# Altium schematic sheet ASCII Terminal.SchDoc
size A4; SheetNumber: 1; SheetTotal: 1
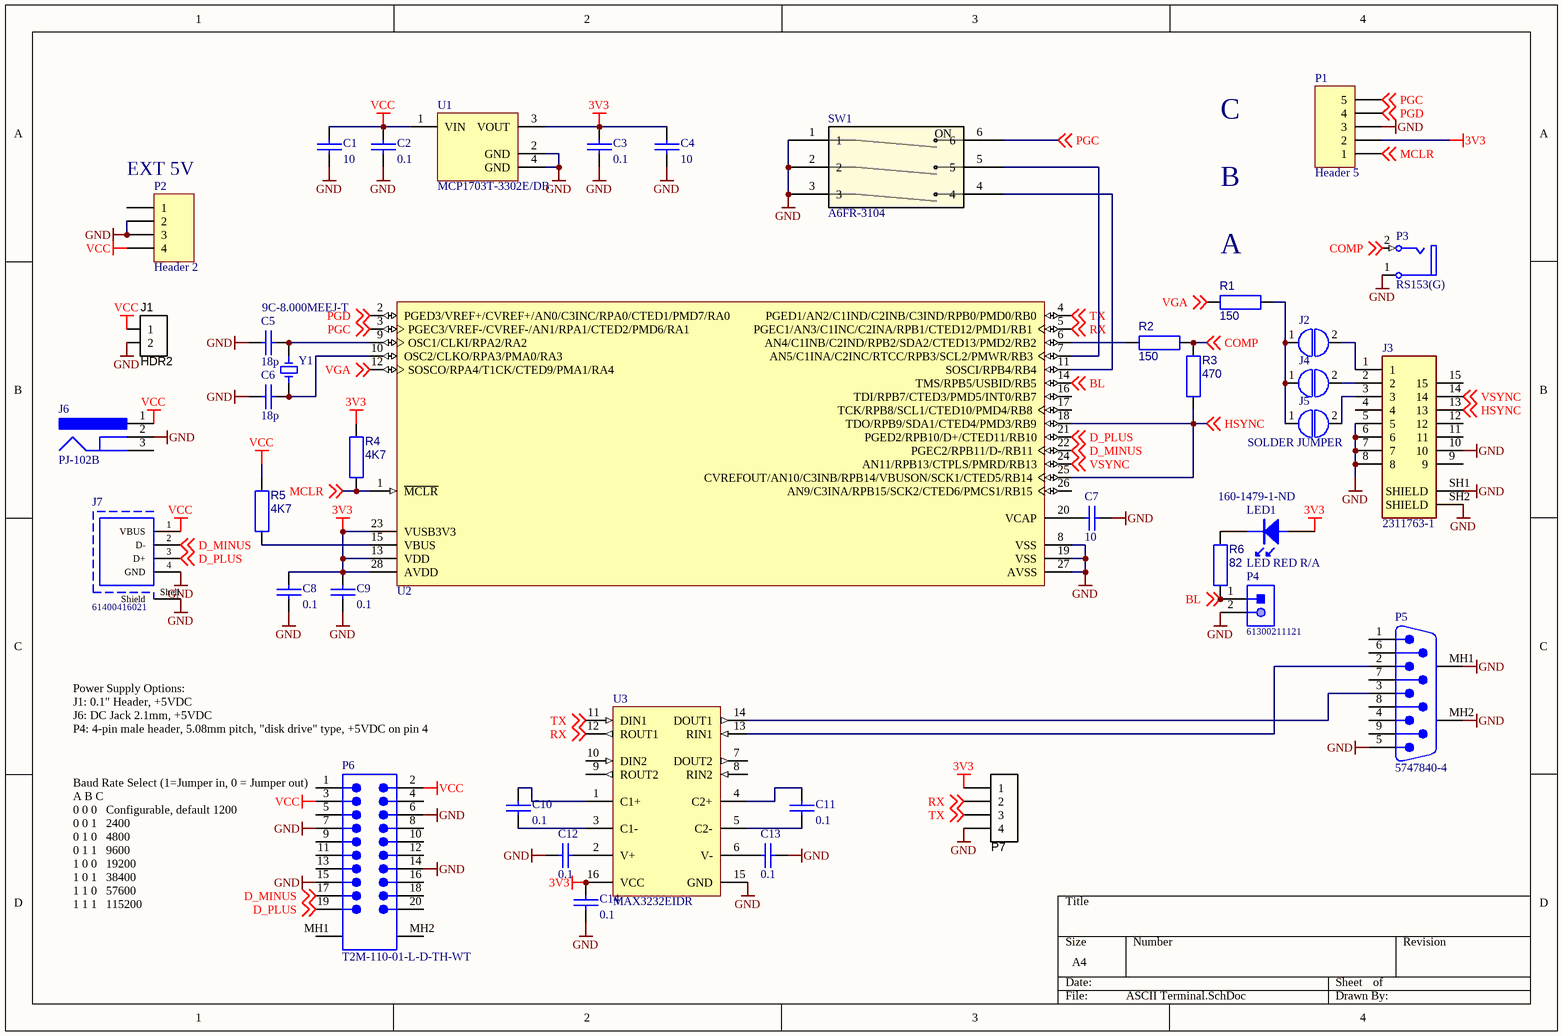
[diagram p0: ASCII Terminal.SchDoc]

## Parts
C1  value 10  [C0805-S]  (hidden comment: VJ0805V475ZXQTW1BC)
C2  value 0.1  [C0805-S]  (hidden comment: VJ0805V475ZXQTW1BC)
C3  value 0.1  [C0805-S]  (hidden comment: VJ0805V475ZXQTW1BC)
C4  value 10  [C0805-S]  (hidden comment: VJ0805V475ZXQTW1BC)
C5  18p  [C0805-S]
C6  18p  [C0805-S]
C7  value 10  [C0805-S]  (hidden comment: VJ0805V475ZXQTW1BC)
C8  value 0.1  [C0805-S]  (hidden comment: VJ0805V475ZXQTW1BC)
C9  value 0.1  [C0805-S]  (hidden comment: VJ0805V475ZXQTW1BC)
C10  value 0.1  [C0805-S]  (hidden comment: VJ0805V475ZXQTW1BC)
C11  value 0.1  [C0805-S]  (hidden comment: VJ0805V475ZXQTW1BC)
C12  value 0.1  [C0805-S]  (hidden comment: VJ0805V475ZXQTW1BC)
C13  value 0.1  [C0805-S]  (hidden comment: VJ0805V475ZXQTW1BC)
C14  value 0.1  [C0805-S]  (hidden comment: VJ0805V475ZXQTW1BC)
J1  HDR2  [HDR1X2 - KK]
J2  SOLDER JUMPER  [SOLDER JUMPER]  (value not drawn)  (no BOM)
J3  2311763-1  [TE_1-1734530-1]
J4  SOLDER JUMPER  [SOLDER JUMPER]  (value not drawn)  (no BOM)
J5  SOLDER JUMPER  [SOLDER JUMPER]  (no BOM)
J6  PJ-102B  [CUI-PJ-102B_V]
J7  61400416021  [61400416021]
LED1  LED RED R/A  Supplier Part Number 1: 160-1479-1-ND  [LTST-S270]
P1  Header 5  [HDR1X5]  (no BOM)
P2  Header 2  [1745521]
P3  RS153(G)  [RCAJ-01X]
P4  61300211121  [61300211121]
P5  5747840-4  [TECO-5747840-4_V]
P6  T2M-110-01-L-D-TH-WT  [SMTC-T2M-110-01-X-D-TH-WT]
P7  Programmer  [HDR1X4_2.54mmp]  (value not drawn)  (no BOM)
R1  150  [RESC2012X70N]
R2  150  [RESC2012X70N]
R3  470  [RESC2012X70N]
R4  4K7  [RESC2012X70N]
R5  4K7  [RESC2012X70N]
R6  82  [RESC2012X70N]
SW1  A6FR-3104  [SW_A6FR-3104_OMR]
U1  MCP1703T-3302E/DB  [SOT-223-DB3_L]
U2  PIC32MX250F128B-I/SO  [MCHP-SOIC-SO28_M]  (value not drawn)
U3  MAX3232EIDR  [D0016A_N]
Y1  9C-8.000MEEJ-T  [XTAL_9C-8.000MEEJ-T]

## Nets
3V3: C3.1 C4.1 C8.1 C9.1 C14.1 LED1.A P1.2 P7.1 R4.2 U1.3(VOUT) U2.13(VDD) U2.23(VUSB3V3) U2.28(AVDD) U3.16(VCC)
GND: C1.2 C2.2 C3.2 C4.2 C5.1 C6.1 C7.2 C8.2 C9.2 C12.1 C13.2 C14.2 J1.2 J3.5 J3.6 J3.7 J3.8 J3.10 J3.SH1(SHIELD) J3.SH2(SHIELD) J6.2 J7.4(GND) J7.Shell(Shield) P1.3 P2.2 P2.3 P3.1(Ground) P4.2 P5.5 P5.MH1 P5.MH2 P6.6 P6.7 P6.14 P6.15 P7.4 SW1.1 SW1.2 SW1.3 U1.2(GND) U1.4(GND) U2.8(VSS) U2.19(VSS) U2.27(AVSS) U3.15(GND)
VCC: C1.1 C2.1 J1.1 J6.1 J7.1(VBUS) P2.4 P6.2 P6.3 R5.2 U1.1(VIN)
BL: P4.1 R6.2 U2.14(TMS/RPB5/USBID/RB5) ; off-sheet BL
COMP: P3.2(Signal) R2.1 R3.1 ; off-sheet COMP
D_MINUS: J7.2(D-) P6.17 U2.22(PGEC2/RPB11/D-/RB11) ; off-sheet D_MINUS
D_PLUS: J7.3(D+) P6.19 U2.21(PGED2/RPB10/D+/CTED11/RB10) ; off-sheet D_PLUS
HSYNC: J3.13 R3.2 U2.18(TDO/RPB9/SDA1/CTED4/PMD3/RB9) U2.25(CVREFOUT/AN10/C3INB/RPB14/VBUSON/SCK1/CTED5/RB14) ; off-sheet HSYNC
MCLR: P1.1 R4.1 U2.1(~{MCLR}) ; off-sheet MCLR
PGC: P1.5 SW1.6 U2.3(PGEC3/VREF-/CVREF-/AN1/RPA1/CTED2/PMD6/RA1) ; off-sheet PGC
PGD: P1.4 U2.2(PGED3/VREF+/CVREF+/AN0/C3INC/RPA0/CTED1/PMD7/RA0) ; off-sheet PGD
RX: P7.2 U2.5(PGEC1/AN3/C1INC/C2INA/RPB1/CTED12/PMD1/RB1) U3.12(ROUT1) ; off-sheet RX
TX: P7.3 U2.4(PGED1/AN2/C1IND/C2INB/C3IND/RPB0/PMD0/RB0) U3.11(DIN1) ; off-sheet TX
VGA: R1.2 U2.12(SOSCO/RPA4/T1CK/CTED9/PMA1/RA4) ; off-sheet VGA
VSYNC: J3.14 U2.24(AN11/RPB13/CTPLS/PMRD/RB13) ; off-sheet VSYNC
NetC5_2: C5.2 U2.9(OSC1/CLKI/RPA2/RA2) Y1.2
NetC6_2: C6.2 U2.10(OSC2/CLKO/RPA3/PMA0/RA3) Y1.1
NetC7_1: C7.1 U2.20(VCAP)
NetC10_1: C10.1 U3.1(C1+)
NetC10_2: C10.2 U3.3(C1-)
NetC11_1: C11.1 U3.4(C2+)
NetC11_2: C11.2 U3.5(C2-)
NetC12_2: C12.2 U3.2(V+)
NetC13_1: C13.1 U3.6(V-)
NetJ2_1: J2.1 J4.1 J5.1 R1.1
NetJ2_2: J2.2 J3.1
NetJ3_2: J3.2 J4.2
NetJ3_3: J3.3 J5.2
NetLED1_K: LED1.K R6.1
NetP5_2: P5.2 U3.13(RIN1)
NetP5_3: P5.3 U3.14(DOUT1)
NetR2_2: R2.2 U2.6(AN4/C1INB/C2IND/RPB2/SDA2/CTED13/PMD2/RB2)
NetR5_1: R5.1 U2.15(VBUS)
NetSW1_4: SW1.4 U2.11(SOSCI/RPB4/RB4)
NetSW1_5: SW1.5 U2.7(AN5/C1INA/C2INC/RTCC/RPB3/SCL2/PMWR/RB3)

Not connected (* = marked no-connect by the designer): J3 4 9 11 12 15; J6 3; P2 1; P5 1 4 6 7 8 9; P6 1 4 5 8 9 10 11 12 13 16 18 20 MH1 MH2; U2 16(TDI/RPB7/CTED3/PMD5/INT0/RB7) 17(TCK/RPB8/SCL1/CTED10/PMD4/RB8) 26(AN9/C3INA/RPB15/SCK2/CTED6/PMCS1/RB15); U3 7(DOUT2) 8(RIN2) 9(ROUT2) 10(DIN2)

## Notes on the sheet
- (near P2) EXT 5V
- C
- B
- (near R1) A
- (near P6) Power Supply Options:
  J1: 0.1" Header, +5VDC
  J6: DC Jack 2.1mm, +5VDC
  P4: 4-pin male header, 5.08mm pitch, "disk drive" type, +5VDC on pin 4
- (near P6) Baud Rate Select (1=Jumper in, 0 = Jumper out)
  A B C
  0 0 0   Configurable, default 1200
  0 0 1   2400
  0 1 0   4800
  0 1 1   9600
  1 0 0   19200
  1 0 1   38400
  1 1 0   57600
  1 1 1   115200
- (in symbol A6FR-3104) ON

## Library data of the parts
C1 C4 C7 = CAP: Capacitor; P/N: LMK212ABJ106KG-T
C2 C3 C8-C14 = CAP: Capacitor; P/N: UMK212BJ104KG-T
C5 C6 = CAP: Capacitor; P/N: VJ0805A180FXXCW1BC; Value: 18p
J1 = Header2P: Header, 2-pin; P/N: 0022232021
J3 = 2311763-2: 15 Position D-Sub, High Density Receptacle, Female Sockets Connector; MP: 1-1734530-1; MF: TE Connectivity; Package: None; TE_purchase_URL: https://www.te.com/usa-en/product-1-1734530-1.html?te_bu=Cor&te_type=disp&te_campaign=seda_glo_cor-seda-global-disp-prtnr-fy19-seda-model-bom-cta_sma-317_1&elqCampaignId=32493; Value: *; SnapEDA_Link: https://www.snapeda.com/parts/1-1734530-1/TE%20Connectivity%20AMP%20Connectors/view-part/289078/?ref=snap; Price: None; P/N: 2311763-1
J6 = CMP-2000-06900-1: Through Hole Right Angle DC Power Jack, 2.5 A, 2.5 mm Center Pin, 3 Position, -25 to 85 degC, RoHS, Bulk; Manufacturer: CUIInc.; Insulation Resistance: 100MOhms; Inside Contact Diameter: 2.5mm; Outside Contact Diameter: 6.5mm; Voltage Rating: 24V; Current Rating: 2.5A; Brand: CUI; Datasheet URL: http://www.cui.com/product/resource/pj-102b.pdf; Housing Material: PolybutyleneTerephthalate(PBT); Operating Temperature Range: -25Cto+85C; Package Reference: PJ-102B; Factory Pack Quantity: 280; RoHS: True; Contact Material: Copper; Datasheet Version: Rev. 1.03, 04/2016; Product: Jacks; Mounting Angle: Right; Mounting Style: ThroughHole; Flammability Rating: UL94V-0; Product Category: DCPowerConnectors; Contact Gender: Male; Termination Style: ThroughHole; Manufacturer URL: http://www.cui.com/; Mounting Technology: ThroughHole; Package Description: 3-Pin Through Hole Device, Body 14.4 x 9 mm, Height 11 mm; Contact Plating: Nickel; Packaging: Bulk; Connector Type: DCPowerJack; P/N: PJ-102B
J7 = CMP-1502-03227-1: USB 2.0 Type A Receptacle WR-COM, Horizontal, THT; Manufacturer: Wurth Elektronik; Working Voltage: 30VAC; Rated Current: 1.5A; Contact Resistance: 20mOhm; Manufacturer URL: http://www.we-online.de; Publisher: WurthElektronik; Packaging: Tray; Operating Temperature: -40to105degC; Orientation: Horizontal; Mounting Technology: THT; Part Number: 61400416021; Gender: Receptacle; Package Reference: 61400416021; Connector Type: USB2.0TypeA; Datasheet URL: https://katalog.we-online.de/em/datasheet/61400416021.pdf; P/N: 61400416021
LED1 = LED_SIDE_1_6_1_15: P/N: LTST-S270KRKT; Supplier 1: Digi-Key
P1 = Header 5: Header, 5-Pin; LatestRevisionDate: 17-Jul-2002; LatestRevisionNote: Re-released for DXP Platform.; Publisher: Altium Limited
P2 = Header 4: Header, 4-Pin; P/N: 174552-1; LatestRevisionDate: 17-Jul-2002; LatestRevisionNote: Re-released for DXP Platform.; Publisher: Altium Limited
P3 = RCA: RCA Phono Jack, Right Angle, Thru-Hole, Snap-In; PCB_Layout: Complies with manufacturer's recommendation.; DrillAndSlotSize: Corresponds to nominal value.; P/N: RCJ-014; Published: 15-Jul-2004; LatestRevisionDate: 15-Jul-2004; LatestRevisionNote: Component Replaced.; DatasheetDocument: 7-Jul-2000; PackageDocument: 7-Jul-2000; PackageReference: 161; Publisher: Altium Limited; ComponentLink1Description: Manufacturer Link; ComponentLink1URL: http://www.mouser.com/kobiconn/
P4 = CMP-1712-00002-4: THT Vertical Pin Header WR-PHD, Pitch 2.54 mm, Single Row, 2 pins; Manufacturer: Wurth Elektronik; Rated Current: 3A; Gender: Male; Withstanding Voltage: 500VAC; Working Voltage: 250VAC; Pitch: 2.54mm; Contact Resistance: 20mOhm; Pin Number: 2; Mounting Technology: THT; Orientation: Vertical; Operating Temperature: -40to105degC; Packaging: Bag; Publisher: WurthElektronik; Datasheet URL: https://katalog.we-online.de/em/datasheet/6130xx11121.pdf; Manufacturer URL: http://www.we-online.de; Row Number: Single; Package Reference: 61300211121; Part Number: 61300211121; P/N: 61300211121
P5 = CMP-2000-05648-1: Male D-Sub Connector, Pitch 1.37 mm, 9 Position, Height 12.93 mm, Tail Length 3.55 mm, -55 to 105 degC, RoHS, Tray; Manufacturer: TE Connectivity; Current Rating: 6A; 3D Model: 5747840-4.pdf; Connector Type: Plug,MalePins; Catalog Drawings: AMPD-SubMale.318; Other Names: A32092; Product Training Modules: AMPLIMITED-SubConnectors; Number of Positions: 9; Dynamic Catalog: AMPLIMITEHD-20Series; Flange Feature: Housing/Shell(4-40); Mating Products: 5-747905-7-ND / -CONND-SUBRCPT9POSVERTSLD / 5-787355-1-ND / -CONNRCPT9POSVERTSOLDERCUP / 5746861-4-ND / -CONNRECEPT9POSGOLDIDC / A32510-ND / -CONND-SUBRCPT9POSSLDCUPAU / AFL09B-ND / -CONND-SUBRECEPT9POS30GOLD / A31975-ND / -CONND-SUBRECEPT9P22-26AWGAU / A31974-ND / -CONND-SUBRECEPT9P20-22AWGAU / A31973-ND / -CONND-SUBRECEPT9P26-30AWGAU / A31931-ND / -CONND-SUBRCPT9POS22-26AWGAU; Featured Product: AMPLIMITED-SubminiatureConnectors; Voltage Rating: 125V; Connector Style: D-Sub; Mounting Technology: ThroughHole; Features: BoardLock,GroundStrap,GroundingIndents; Operating Temperature: -55°C~105°C; Standard Package: 130; Termination: Solder; Contact Finish: Gold; Family: D-SubConnectors; Package Reference: 5747840-4; Package Description: 9-Pin Through Hole Device, Body 30.81 x 18.62 mm, Pitch 1.37 mm; Category: Connectors,Interconnects; Series: AMPLIMITEHD-20; Manufacturer URL: http://www.te.com/; Shell Size, Connector Layout: 1(DE,E); Color: Black; RoHS Information: 5747840-4StatementofCompliance; Shell Material, Finish: Steel,TinPlated; Datasheet URL: http://www.te.com/commerce/DocumentDelivery/DDEController?Action=showdoc&DocId=Customer+Drawing%7F5747840%7FD%7Fpdf%7FEnglish%7FENG_CD_5747840_D.pdf%7F5747840-4; Contact Finish Thickness: Flash; Datasheet Version: Rev. D, 01/2013; Mounting Type: ThroughHole,RightAngle; Number of Rows: 2; Contact Type: Signal; P/N: 5747840-4
P6 = CMP-1029-00094-1: High Reliability Cable Header, Through-hole, Vertical, -55 to 125 degC, 2 mm Pitch, 20-Pin, Male, RoHS; Manufacturer: Samtec; Pitch: 2 mm; ComponentLink3URL: http://www.samtec.com/documents/webfiles/cpdf/T2M-1XX-XX-X-D-XX-XX-MKT.pdf; Mounting Technology: Through-hole; Orientation: Vertical; ComponentLink2URL: http://d2a072wq521u33.cloudfront.net/catalog_english//t2m.pdf; ComponentLink1URL: http://www.samtec.com; ComponentLink2Description: Datasheet; PackageReference: T2M-110-01-X-D-TH-WT; ComponentLink1Description: Manufacturer URL; RoHS: True; ComponentLink3Description: Package Specification; PartNumber: T2M-110-01-L-D-TH-WT; PackageDescription: 2mm Shrouded Terminal Strip; PackageVersion: V, 3/2009; Temperature Range: -55 to 125 degC; DatasheetVersion: F-214; P/N: T2M-110-01-L-D-TH-WT
P7 = Header4P: Header 4-pin
R1 R2 = RES2: RESISTOR; P/N: CRCW0805150RFKEAC; Value: 150
R3 = RES2: RESISTOR; P/N: CRCW0805470RFKEAC; Value: 470
R4 R5 = RES2: RESISTOR; P/N: CRCW08054K70FKEAC; Value: 4K7
R6 = RES2: RESISTOR; P/N: CRCW080582R0FKEAC; Value: 82
SW1 = A6FR-3104: No Description Available; Built_By: EMA_Kyle; Vendor: Omron; SourceLibrary: Omron_2019-09-26; Copyright: Copyright (C) 2018 Accelerated Designs. All rights reserved; Manufacturer_Part_Number: A6FR-3104; RefDes: RefDes; Type: DEV; P/N: A6FR-3104
U1 = CMP-0136-00469-1: 250 mA, 16V, Low Quiescent Current LDO Regulator, 3-Pin SOT-223, Extended Temperature, Tape and Reel; PackageReference: SOT-223-DB3; PackageDescription: 3-Lead Plastic Small Outline Transistor (DB) [SOT-223]; PackageVersion: revBB, Aug-2009; DatasheetVersion: revD, Sep-2009; P/N: MCP1703T-3302E/DB
U2 = CMP-0048-00457-1: 32-bit Microcontroller with Audio and Graphics Interface, USB and Advanced Analog, 50 MHz, 19 I/O, PMP, -40 to 85 degC, 28-pin SOIC (SO28), Tube; Manufacturer: Microchip; DatasheetVersion: Rev. E; PartNumber: PIC32MX250F128B-I/SO; ComponentLink4Description: Product URL; Mounting Technology: Surface Mount; ComponentLink2Description: Datasheet; PackageDescription: 28-Lead Plastic Small Outline, 17.9 x 7.5 mm Body, 1.27 mm Pitch; ComponentLink3Description: Package Specification; ComponentLink1Description: Manufacturer URL; PackageReference: SOIC-SO28; PackageVersion: C04-052C; ComponentLink2URL: http://ww1.microchip.com/downloads/en/DeviceDoc/61168E.pdf; ComponentLink3URL: http://www.microchip.com/stellent/groups/techpub_sg/documents/packagingspec/en012702.pdf; ComponentLink4URL: http://www.microchip.com/PIC32MX250F128B; ComponentLink1URL: http://www.microchip.com; P/N: PIC32MX250F128B-I/SO
U3 = CMP-0299-00792-2: 3-V to 5.5-V Multichannel RS-232 Line Driver / Receiver with ±15-kV IEC ESD Protection, -40 to 85 degC, 16-Pin SOIC (D), Green (RoHS & no Sb/Br); Drivers Per Package: 2; IEC-61000-4-2 SUPPORT: TRUE; Supply Voltage(s)(V): 3.3 or 5.0; ICC(Max)(mA): 1; ESD HBM(kV): +/-15; PackageVersion: revM, Jun-2011; ComponentLink2URL: http://www.ti.com/general/docs/lit/getliterature.tsp?genericPartNumber=MAX3232E&fileType=pdf; PackageReference: D0016A; DatasheetVersion: SLLS664A; ComponentLink3Description: Package Specification; PackageDescription: 16-Pin Plastic Small Outline Integrated Circuit, 9.9 x 3.9 mm, Pitch 1.27 mm Pitch; SubFamily: RS-232; Single Supply: TRUE; RS-232: TRUE; ComponentLink1Description: Manufacturer URL; ComponentLink1URL: www.ti.com; ComponentLink3URL: http://www.ti.com/litv/pdf/mpds178g; Receivers Per Package: 2; ComponentLink2Description: Datasheet; P/N: MAX3232EIDR
Y1 = 9C-8.000MEEJ-T: 8MHz Â±10ppm Crystal 18pF 80 Ohms HC-49/US; MF: TXC CORPORATION; Value: *; Package: HC49/US TXC; SnapEDA_Link: https://www.snapeda.com/parts/9C-8.000MEEJ-T/TXC%20CORPORATION/view-part/493807/?ref=snap; Price: None; MP: 9C-8.000MEEJ-T; P/N: 9C-8.000MEEJ-T